# Altium project LM2731.PrjPcb
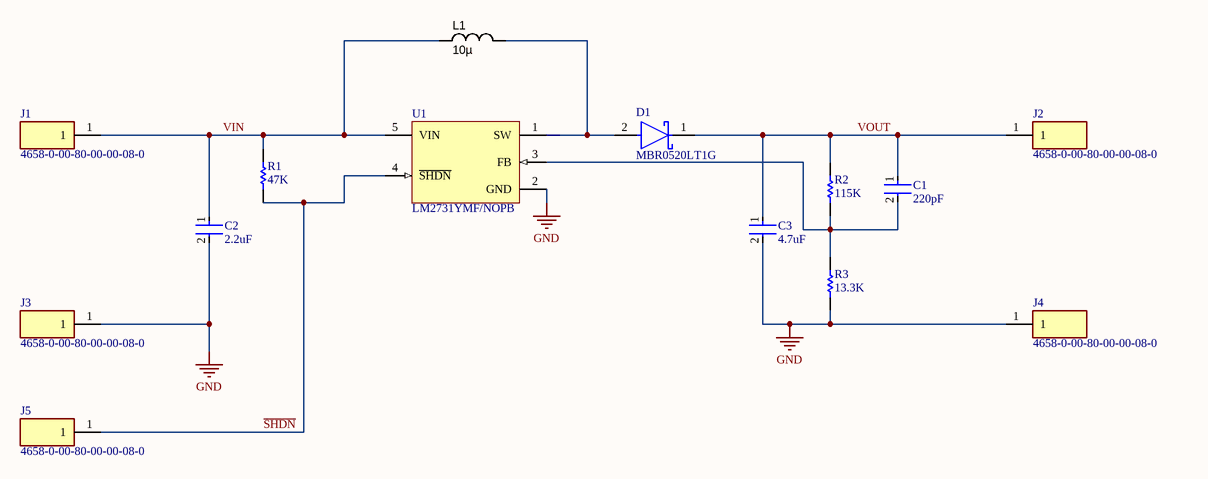
[diagram p0: lm2731.SchDoc]
1 sheet, 14 parts. Net scope: global (net labels, ports and power ports of the same name join across sheets).
Board file: boost_converter.PcbDoc

## Sheet lm2731.SchDoc: Title
size A4; Date: *******; ApprovedBy: *******; CheckedBy: None; Author: *******; CompanyName: *******; DrawnBy: Name; Engineer: *******; Organization: *******; Address1: *******; Address2: *******; Address3: *******; Address4: *******; DocumentNumber: Doc Num; Revision: *******; SheetNumber: 1; SheetTotal: 1; CurrentTime: *******; CurrentDate: *******; Time: *******; DocumentFullPathAndName: *******; DocumentName: *******; ModifiedDate: *******; ImagePath: *******; ProjectName: *******; Application_BuildNumber: *******

### Parts
C1  220pF  [FP-CL10-IPC_C]
C2  2.2uF  [FP-GRM188-0_2-IPC_C]
C3  4.7uF  [FP-GRM31C-0_2-e0_3_0_8-IPC_C]
D1  MBR0520LT1G  [FP-425-04-IPC_C]
J1  4658-0-00-80-00-00-08-0  [4658000800000080]
J2  4658-0-00-80-00-00-08-0  [4658000800000080]
J3  4658-0-00-80-00-00-08-0  [4658000800000080]
J4  4658-0-00-80-00-00-08-0  [4658000800000080]
J5  4658-0-00-80-00-00-08-0  [4658000800000080]
L1  10µ  [INDC3225X250N]
R1  47K  [RESC1608X55X30ML15T15]
R2  115K  [RESC1608X55X30ML15T15]
R3  13.3K  [RESC1608X55X30LL15T15]
U1  LM2731YMF/NOPB  [DBV0005A_N]

### Nets
GND: C2.2 C3.2 J3.1 J4.1 R3.1 U1.2(GND)
~{SHDN}: J5.1 R1.1 U1.4(~{SHDN})
VIN: C2.1 J1.1 L1.1 R1.2 U1.5(VIN)
VOUT: C1.1 C3.1 D1.1(C) J2.1 R2.2
NetC1_2: C1.2 R2.1 R3.2 U1.3(FB)
NetD1_2: D1.2(A) L1.2 U1.1(SW)

### Notes on the sheet
- Date:
- Title
- Size:
- A4
- Number:
- Sheet
- Revision:
- of
- Designer:

### Library data of the parts
C1 = CMP-13271-002543-1: Cap Ceramic 220pF 50V C0G ±5% Pad SMD 0603 +125°C T/R; Temperature Coefficient: 300ppm/°C; Contact Plating: Tin; Voltage Rating (DC): 50V; Case/Package: 0603; Case Code (Metric): 1608; Length: 1.6mm; Depth: 0.8mm; Package Quantity: 1; Lead Free: Lead Free; Mount: Surface Mount; Min Operating Temperature: -55°C; Voltage: 50V; Case Code (Imperial): 0603; Radiation Hardening: No; Max Operating Temperature: 125°C; Material: Ceramic; Dielectric: C0G; Voltage Rating: 50V; Capacitance: 220pF; Width: 0.031inch; Thickness: 0.035inch; Height: 0.8mm; Packaging: Tape and Reel; Tolerance: 5%
C2 = CMP-06035-042125-1: Chip Multilayer Ceramic Capacitors for General Purpose, 0603, 2.2uF, X5R, 15%, 10%, 50V; Case Code (Metric): 1608; Packaging: Cut Tape; REACH SVHC: No SVHC; Material: Ceramic; Voltage Rating: 50V; Min Operating Temperature: -55°C; Length: 0.063inch; Case Code (Imperial): 0603; Tolerance: 10%; Capacitance: 2.2uF; Thickness: 0.039inch; Height: 0.8mm; Case/Package: 0603; Voltage Rating (DC): 50V; Dielectric: X5R; Mount: Surface Mount; Max Operating Temperature: 85°C; Width: 0.031inch
C3 = CMP-1037-04923-3: Chip Multilayer Ceramic Capacitors for General Purpose, 1206, 4.7uF, X7R, 15%, 10%, 50V; Height: 1.6mm; Voltage: 50V; Capacitance: 4.7uF; Lead Free: Lead Free; Max Operating Temperature: 125°C; Packaging: Tape and Reel; REACH SVHC: No SVHC; Voltage Rating: 50V; Mount: Surface Mount; Termination: SMD/SMT; Tolerance: 10%; Case/Package: 1206; Material: Ceramic; Depth: 1.6mm; Length: 3.2mm; Case Code (Metric): 3216; Voltage Rating (DC): 50V; Case Code (Imperial): 1206; Radiation Hardening: No; Width: 0.063inch; Thickness: 0.071inch; Package Quantity: 2000; Min Operating Temperature: -55°C; Dielectric: X7R
D1 = CMP-1055-00425-2: DIODE SCHOTTKY 20V 500MA SOD123; Polarity: Standard; Peak Non-Repetitive Surge Current: 5.5A; Forward Voltage: 385mV; Element Configuration: Single; Peak Reverse Current: 250uA; Max Repetitive Reverse Voltage (Vrrm): 20V; Voltage Rating (DC): 20V; Case/Package: SOD-123-2; Number of Pins: 2; Output Current: 500mA; Min Operating Temperature: -65°C; Lead Free: Lead Free; REACH SVHC: No SVHC; Max Reverse Voltage (DC): 20V; Termination: SMD/SMT; Average Rectified Current: 500mA; Max Surge Current: 5.5A; Package Quantity: 3000; Height: 1.12mm; Current Rating: 500mA; Forward Current: 500mA; Max Forward Surge Current (Ifsm): 5.5A; Packaging: Tape and Reel; Length: 2.69mm; Radiation Hardening: No; Max Reverse Leakage Current: 250uA; Width: 1.6mm; Contact Plating: Tin; Max Operating Temperature: 125°C
J1-J5 = 4658-0-00-80-00-00-08-0: Connector; Manufacturer_Name: Mill-Max; Datasheet Link: https://www.mouser.com/datasheet/2/273/223.3-1143706.pdf; Height: 2.8702mm; Manufacturer_Part_Number: 4658-0-00-80-00-00-08-0; Mouser Part Number: 575-4658000800000080; Mouser Price/Stock: https://www.mouser.com/Search/Refine.aspx?Keyword=575-4658000800000080
L1 = INDC_10u_LowRDC: Inductor SMD Low DCR 10 µH 900mA 20% 1210; Manufacturer 1: Taiyo Yuden; Manufacturer Part Number 1: CBC3225T100MR; Ratings: 900 mA; 133 mOhm; DC Resistance (DCR): 172.9 mOhm Max; Frequency - Self Resonant: 23MHz; Frequency - Test: 100kHz; SCDType: spec; Tolerance: ±20%; Supplier 1: Digi-Key; Supplier Part Number 1: 587-1625-1-ND; Current: 900mA; Current - Saturation: 900mA; Current - Temperature Rise: 900mA; Applications: Power Supplies; Package / Case: 1210 (3225 Metric); Operating Temperature: -40°C ~ 105°C; ComponentLink1URL: http://www.yuden.co.jp/ut/product/pdf/wound02_e.pdf; ComponentLink1Description: http://www.yuden.co.jp/ut/product/pdf/wound02_e.pdf; Value: 10µ
R1 = CMP-2000-00523-2: Chip Resistor, 47 KOhm, +/- 1%, 0.1 W, -55 to 155 degC, 0603 (1608 Metric), RoHS, Tape and Reel; Manufacturer Part Number: ERJ3EKF4702V; Case\Package: 0603; Forward Current: 20 mA; Power Rating: 90 mW; Illumination Colour: Red; Nominal Vf: 2.1 V; Viewing Angle: 160 degrees; Luminous Intensity: 63 mcd; Lens Style: Clear; Nominal Wavelength: 639 nm; Case Code (Imperial): 0603; Case Code (Metric): 1608; Packaging: Tape and Reel; Radiation Hardening: No; Colour: Red; PackageDescription: 2-Pin Surface Mount Device, Body 1.6 x 0.85 mm; ComponentLink1Description: Manufacturer URL; Width: 0.8 mm; DatasheetVersion: Apr-15; ComponentLink2URL: http://industrial.panasonic.com/cdbs/www-data/pdf/RDA0000/AOA0000C86.pdf; Min Operating Temperature: -40 degC; Height: 0.6 mm; Package Quantity: 3000; ComponentLink2Description: Datasheet; REACH SVHC: No SVHC; ComponentLink1URL: http://www.panasonic.com/; Mount: Surface Mount; RoHSCompliant: true; Max Operating Temperature: 100 degC; PackageReference: 0603; Length: 1.6 mm; Forward Voltage: 2.1 V; Pins: 2; Resistance: 47K; Package: 0603
R2 = CMP-2000-00208-1: Manufacturer: Panasonic; Part Number: ERJ-3EKF1153V; Resistance: 115K; Package: 0603; Manufacturer Part Number: ERJ-3EKF1153V
R3 = CMP-2000-00238-1: Manufacturer: Panasonic; Part Number: ERJ-3EKF1332V; Resistance: 13.3K; Package: 0603; Manufacturer Part Number: ERJ-3EKF1332V
U1 = CMP-0069-01234-3: 0.6/1.6 MHz Boost Converters With 22V Internal FET Switch in 5-pin SOT-23, Pb-Free; Manufacturer: Texas Instruments; PackageTopMarking: S51B*XTT; CompType: Switcher; PowerWise: N; PackageDescription: Molded SOT-23, .115 x .063 x .040 in Body, 5 Lead, .0375 in Pitch; PinCount: 5; ComponentLink1Description: Datasheet URL; ComponentLink1URL: http://www.ti.com/general/docs/lit/getliterature.tsp?genericPartNumber=LM2731&fileType=pdf; PackageReference: DBV0005A; RoHS: Y